# Altium schematic sheet BG95.SchDoc
size Tabloid; SheetNumber: 1; SheetTotal: 1
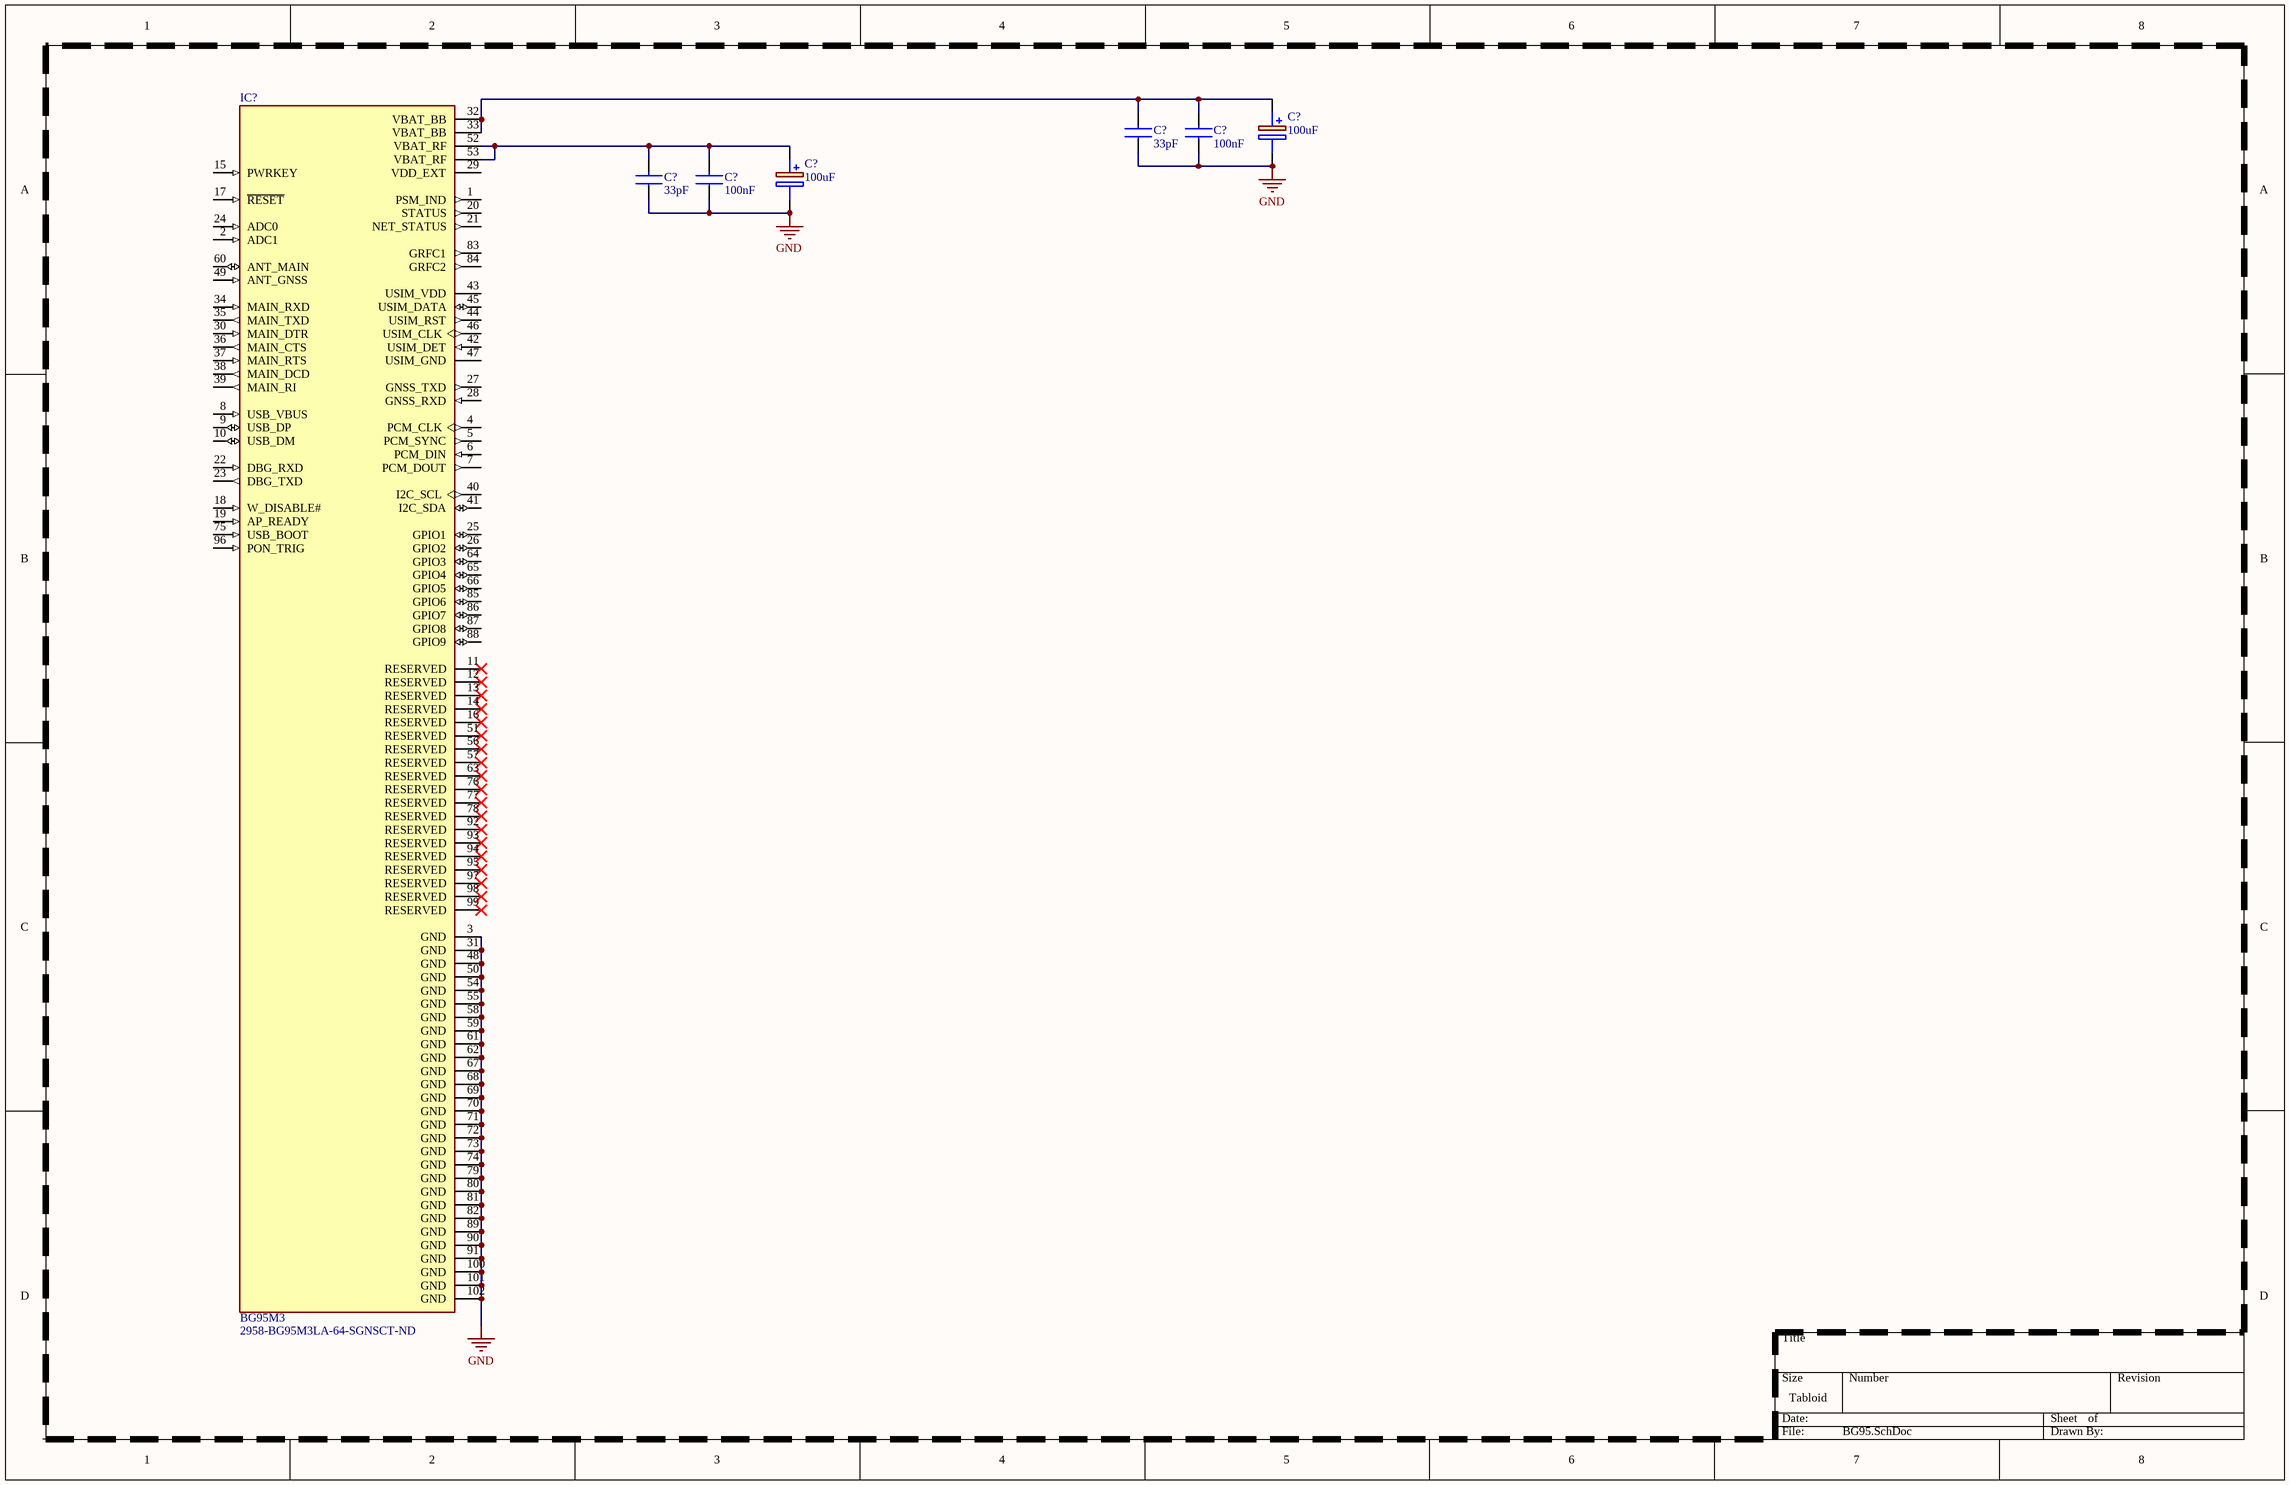
[diagram p0: BG95.SchDoc]

## Parts
(Parts that share a designator on the sheet are numbered #1, #2 ... from top to bottom, then left to right.)
C?#1  100uF  [865080343009]
C?#2  100uF  [865080343009]
C?#3  33pF  [CAPC1005X55N]
C?#4  100nF  [CAPC1005X55N]
C?#5  33pF  [CAPC1005X55N]
C?#6  100nF  [CAPC1005X55N]
IC?  BG95M3  Supplier Part Number 1: 2958-BG95M3LA-64-SGNSCT-ND  [XCVR_BG95M3LA-64-SGNS]

## Nets
GND: C?#1.2(-) C?#2.2(-) C?#3.1 C?#4.1 C?#5.1 C?#6.1 IC?.3(GND) IC?.31(GND) IC?.48(GND) IC?.50(GND) IC?.54(GND) IC?.55(GND) IC?.58(GND) IC?.59(GND) IC?.61(GND) IC?.62(GND) IC?.67(GND) IC?.68(GND) IC?.69(GND) IC?.70(GND) IC?.71(GND) IC?.72(GND) IC?.73(GND) IC?.74(GND) IC?.79(GND) IC?.80(GND) IC?.81(GND) IC?.82(GND) IC?.89(GND) IC?.90(GND) IC?.91(GND) IC?.100(GND) IC?.101(GND) IC?.102(GND)
NetC?#1_1: C?#1.1(+) C?#3.2 C?#4.2 IC?.32(VBAT_BB) IC?.33(VBAT_BB)
NetC?#2_1: C?#2.1(+) C?#5.2 C?#6.2 IC?.52(VBAT_RF) IC?.53(VBAT_RF)

Not connected (* = marked no-connect by the designer): IC? 1(PSM_IND) 2(ADC1) 4(PCM_CLK) 5(PCM_SYNC) 6(PCM_DIN) 7(PCM_DOUT) 8(USB_VBUS) 9(USB_DP) 10(USB_DM) 11(RESERVED)* 12(RESERVED)* 13(RESERVED)* 14(RESERVED)* 15(PWRKEY) 16(RESERVED)* 17(~{RESET}) 18(W_DISABLE#) 19(AP_READY) 20(STATUS) 21(NET_STATUS) 22(DBG_RXD) 23(DBG_TXD) 24(ADC0) 25(GPIO1) 26(GPIO2) 27(GNSS_TXD) 28(GNSS_RXD) 29(VDD_EXT) 30(MAIN_DTR) 34(MAIN_RXD) 35(MAIN_TXD) 36(MAIN_CTS) 37(MAIN_RTS) 38(MAIN_DCD) 39(MAIN_RI) 40(I2C_SCL) 41(I2C_SDA) 42(USIM_DET) 43(USIM_VDD) 44(USIM_RST) 45(USIM_DATA) 46(USIM_CLK) 47(USIM_GND) 49(ANT_GNSS) 51(RESERVED)* 56(RESERVED)* 57(RESERVED)* 60(ANT_MAIN) 63(RESERVED)* 64(GPIO3) 65(GPIO4) 66(GPIO5) 75(USB_BOOT) 76(RESERVED)* 77(RESERVED)* 78(RESERVED)* 83(GRFC1) 84(GRFC2) 85(GPIO6) 86(GPIO7) 87(GPIO8) 88(GPIO9) 92(RESERVED)* 93(RESERVED)* 94(RESERVED)* 95(RESERVED)* 96(PON_TRIG) 97(RESERVED)* 98(RESERVED)* 99(RESERVED)*

## Library data of the parts
C?#1 C?#2 = 865080343009: Alum. Electrolytic Cap 100uF 16V 6.3mmV-Chip WCAP-ASLI, Lifetime 2000h +105oC; Manufacturer: Wurth Elektronik; Value: 100µF; ESR (Equivalent Series Resistance): 399.422mΩ; Impedance: 520mΩ; Insulation Resistance: 1MΩ; Leakage Current: 16µA; Life (Hours): 2000hours; Polarity: Polar; Ripple Current: 255mA; Tolerance: 20%; Supplier: DigiKey; Supplier Part Number: 732-8419-1-ND; Manufacturer Part Number: 865080343009; RoHS: Compliant; Category: Aluminum Electrolytic Capacitors; Stock: 52412; Pricing: 1=0.28, 50=0.241, 100=0.21, 250=0.186, 500=0.163 (USD); Case/Package: Radial; Diameter: 6.3mm; Height: 5.5mm; Height - Seated (Max): 5.5118mm; Lead Free: Lead Free; Length: 5.5mm; Max Operating Temperature: 105°C; Min Operating Temperature: -55°C; Mounting Technology: Surface Mount; REACH SVHC: Unknown; Ripple Current (AC): 255mA; Voltage Rating: 16V; Voltage Rating (DC): 16V; Width: 6.6mm; ComponentLink1URL: https://datasheet.octopart.com:443/865080343009-Wurth-Elektronik-datasheet-168508400.pdf?src-supplier=Farnell; ComponentLink1Description: https://datasheet.octopart.com:443/865080343009-Wurth-Elektronik-datasheet-168508400.pdf?src-supplier=Farnell; ComponentLink2URL: https://datasheet.octopart.com:443/865080343009-W%C3%BCrth-Elektronik-datasheet-37144384.pdf?src-supplier=Future+Electronics; ComponentLink2Description: https://datasheet.octopart.com:443/865080343009-W%C3%BCrth-Elektronik-datasheet-37144384.pdf?src-supplier=Future+Electronics
C?#3 C?#5 = CL05C330JB5NNNC: 50V 33pF C0G ±5% 0402 Multilayer Ceramic Capacitors MLCC - SMD/SMT ROHS; Manufacturer: Samsung Electro-Mechanics; Temperature Coefficient: 30ppm/°C; Supplier: DigiKey; Supplier Part Number: 1276-1272-6-ND; Manufacturer Part Number: CL05C330JB5NNNC; RoHS: Compliant; Category: Ceramic Capacitors; Stock: 3336272; Pricing: 1=0.08, 10=0.005, 50=0.004, 100=0.0032 (USD); Value: 33pF; Case/Package: 0402; Case Code (Imperial): 0402; Case Code (Metric): 1005; China RoHS: Compliant; Contact Plating: Tin; Depth: 500µm; Dielectric: C0G; Dielectric Material: Ceramic; Height: 550µm; Lead Free: Lead Free; Length: 1mm; Lifecycle Status: Production; Material: Ceramic; Max Operating Temperature: 125°C; Min Operating Temperature: -55°C; Mounting Technology: Surface Mount; Number of Terminals: 2; Radiation Hardening: No; REACH SVHC: Yes; Schedule B: 8532240020, 8532240020|8532240020, 8532240020|8532240020|8532240020, 8532240020|8532240020|8532240020|8532240020; Thickness: 558.8µm; Tolerance: 5%; Voltage: 50V; Voltage Rating: 50V; Voltage Rating (DC): 50V; Width: 500µm; ComponentLink1URL: https://datasheet.octopart.com:443/CL05C330JB5NNNC-Samsung-Electro-Mechanics-datasheet-136482269.pdf?src-supplier=IHS; ComponentLink1Description: https://datasheet.octopart.com:443/CL05C330JB5NNNC-Samsung-Electro-Mechanics-datasheet-136482269.pdf?src-supplier=IHS; ComponentLink2URL: https://datasheet.octopart.com:443/CL05C330JB5NNNC-Samsung-Electro-Mechanics-datasheet-141347004.pdf?src-supplier=Samsung+SCT; ComponentLink2Description: https://datasheet.octopart.com:443/CL05C330JB5NNNC-Samsung-Electro-Mechanics-datasheet-141347004.pdf?src-supplier=Samsung+SCT; ComponentLink3URL: https://datasheet.octopart.com:443/CL05C330JB5NNNC-Samsung-Electro-Mechanics-datasheet-110326805.pdf?src-supplier=Future+Electronics; ComponentLink3Description: https://datasheet.octopart.com:443/CL05C330JB5NNNC-Samsung-Electro-Mechanics-datasheet-110326805.pdf?src-supplier=Future+Electronics; ComponentLink4URL: https://datasheet.octopart.com:443/CL05C330JB5NNNC-Samsung-Electro-Mechanics-datasheet-81461748.pdf?src-supplier=Future+Electronics; ComponentLink4Description: https://datasheet.octopart.com:443/CL05C330JB5NNNC-Samsung-Electro-Mechanics-datasheet-81461748.pdf?src-supplier=Future+Electronics; ComponentLink5URL: https://datasheet.octopart.com:443/CL05C330JB5NNNC-Samsung-datasheet-12522687.pdf?src-supplier=Future+Electronics; ComponentLink5Description: https://datasheet.octopart.com:443/CL05C330JB5NNNC-Samsung-datasheet-12522687.pdf?src-supplier=Future+Electronics; ComponentLink6URL: https://datasheet.octopart.com:443/CL05C330JB5NNNC-Samsung-datasheet-26589087.pdf?src-supplier=Future+Electronics; ComponentLink6Description: https://datasheet.octopart.com:443/CL05C330JB5NNNC-Samsung-datasheet-26589087.pdf?src-supplier=Future+Electronics; ComponentLink7URL: https://datasheet.octopart.com:443/CL05C330JB5NNNC-Samsung-Electro-Mechanics-datasheet-149156440.pdf?src-supplier=Future+Electronics; ComponentLink7Description: https://datasheet.octopart.com:443/CL05C330JB5NNNC-Samsung-Electro-Mechanics-datasheet-149156440.pdf?src-supplier=Future+Electronics; ComponentLink8URL: https://datasheet.octopart.com:443/CL05C330JB5NNNC-Samsung-datasheet-37081328.pdf?src-supplier=Future+Electronics; ComponentLink8Description: https://datasheet.octopart.com:443/CL05C330JB5NNNC-Samsung-datasheet-37081328.pdf?src-supplier=Future+Electronics; ComponentLink9URL: https://datasheet.octopart.com/CL05C330JB5NNNC-Samsung-Electro-Mechanics-datasheet-97040617.pdf; ComponentLink9Description: https://datasheet.octopart.com/CL05C330JB5NNNC-Samsung-Electro-Mechanics-datasheet-97040617.pdf; ComponentLink10URL: https://datasheet.octopart.com/CL05C330JB5NNNC-Samsung-Electro-Mechanics-datasheet-8324245.pdf; ComponentLink10Description: https://datasheet.octopart.com/CL05C330JB5NNNC-Samsung-Electro-Mechanics-datasheet-8324245.pdf; ComponentLink11URL: https://datasheet.octopart.com:443/CL05C330JB5NNNC-Samsung-datasheet-8326407.pdf?src-supplier=TME; ComponentLink11Description: https://datasheet.octopart.com:443/CL05C330JB5NNNC-Samsung-datasheet-8326407.pdf?src-supplier=TME
C?#4 C?#6 = CL05B104KP5NNNC: 10V 100nF X7R ±10% 0402 Multilayer Ceramic Capacitors MLCC - SMD/SMT ROHS; Manufacturer: Samsung Electro-Mechanics; Supplier: DigiKey; Supplier Part Number: 1276-1002-1-ND; Manufacturer Part Number: CL05B104KP5NNNC; RoHS: Compliant; Category: Ceramic Capacitors; Stock: 29106597; Pricing: 1=0.08, 10=0.004 (USD); Value: 100nF; Case/Package: 0402; Case Code (Imperial): 0402; Case Code (Metric): 1005; China RoHS: Compliant; Contact Plating: Tin; Depth: 500µm; Dielectric: X7R; Dielectric Material: Ceramic; Height: 500µm; Length: 1mm; Lifecycle Status: Production; Material: Ceramic; Max Operating Temperature: 125°C; Min Operating Temperature: -55°C; Mounting Technology: Surface Mount; Number of Terminals: 2; Radiation Hardening: No; REACH SVHC: Yes; Schedule B: 8532240020, 8532240020|8532240020, 8532240020|8532240020|8532240020, 8532240020|8532240020|8532240020|8532240020; Thickness: 558.8µm; Tolerance: 10%; Voltage Rating: 10V; Voltage Rating (DC): 10V; Width: 500µm; ComponentLink1URL: https://datasheet.octopart.com:443/CL05B104KP5NNNC-Samsung-Electro-Mechanics-datasheet-182018737.pdf?src-supplier=IHS; ComponentLink1Description: https://datasheet.octopart.com:443/CL05B104KP5NNNC-Samsung-Electro-Mechanics-datasheet-182018737.pdf?src-supplier=IHS; ComponentLink2URL: https://datasheet.octopart.com/CL05B104KP5NNNC-Samsung-Electro-Mechanics-datasheet-8324245.pdf; ComponentLink2Description: https://datasheet.octopart.com/CL05B104KP5NNNC-Samsung-Electro-Mechanics-datasheet-8324245.pdf; ComponentLink3URL: https://datasheet.octopart.com/CL05B104KP5NNNC-Samsung-Electro-Mechanics-datasheet-97040617.pdf; ComponentLink3Description: https://datasheet.octopart.com/CL05B104KP5NNNC-Samsung-Electro-Mechanics-datasheet-97040617.pdf; ComponentLink4URL: https://datasheet.octopart.com/General-Multilayer-Ceramic-Capacitors-Samsung-datasheet-family-111.pdf; ComponentLink4Description: https://datasheet.octopart.com/General-Multilayer-Ceramic-Capacitors-Samsung-datasheet-family-111.pdf; ComponentLink5URL: https://datasheet.octopart.com:443/CL05B104KP5NNNC-Samsung-Electro-Mechanics-datasheet-141346865.pdf?src-supplier=Samsung+SCT; ComponentLink5Description: https://datasheet.octopart.com:443/CL05B104KP5NNNC-Samsung-Electro-Mechanics-datasheet-141346865.pdf?src-supplier=Samsung+SCT; ComponentLink6URL: https://datasheet.octopart.com:443/CL05B104KP5NNNC-Samsung-Electro-Mechanics-datasheet-116890912.pdf?src-supplier=Future+Electronics; ComponentLink6Description: https://datasheet.octopart.com:443/CL05B104KP5NNNC-Samsung-Electro-Mechanics-datasheet-116890912.pdf?src-supplier=Future+Electronics; ComponentLink7URL: https://datasheet.octopart.com:443/CL05B104KP5NNNC-Samsung-Electro-Mechanics-datasheet-81461625.pdf?src-supplier=Future+Electronics; ComponentLink7Description: https://datasheet.octopart.com:443/CL05B104KP5NNNC-Samsung-Electro-Mechanics-datasheet-81461625.pdf?src-supplier=Future+Electronics; ComponentLink8URL: https://datasheet.octopart.com:443/CL05B104KP5NNNC-Samsung-datasheet-42485124.pdf?src-supplier=Future+Electronics; ComponentLink8Description: https://datasheet.octopart.com:443/CL05B104KP5NNNC-Samsung-datasheet-42485124.pdf?src-supplier=Future+Electronics; ComponentLink9URL: https://datasheet.octopart.com:443/CL05B104KP5NNNC-Samsung-datasheet-26589026.pdf?src-supplier=Future+Electronics; ComponentLink9Description: https://datasheet.octopart.com:443/CL05B104KP5NNNC-Samsung-datasheet-26589026.pdf?src-supplier=Future+Electronics; ComponentLink10URL: https://datasheet.octopart.com:443/CL05B104KP5NNNC-Samsung-Electro-Mechanics-datasheet-149136717.pdf?src-supplier=Future+Electronics; ComponentLink10Description: https://datasheet.octopart.com:443/CL05B104KP5NNNC-Samsung-Electro-Mechanics-datasheet-149136717.pdf?src-supplier=Future+Electronics; ComponentLink11URL: https://datasheet.octopart.com:443/CL05B104KP5NNNC-Samsung-Electro-Mechanics-datasheet-17925223.pdf?src-supplier=iiiC; ComponentLink11Description: https://datasheet.octopart.com:443/CL05B104KP5NNNC-Samsung-Electro-Mechanics-datasheet-17925223.pdf?src-supplier=iiiC; ComponentLink12URL: https://datasheet.octopart.com:443/CL05B104KP5NNNC-Samsung-datasheet-8326407.pdf?src-supplier=TME; ComponentLink12Description: https://datasheet.octopart.com:443/CL05B104KP5NNNC-Samsung-datasheet-8326407.pdf?src-supplier=TME; ComponentLink13URL: http://sigma.octopart.com:80/rohs_certificate/General-Multilayer-Ceramic-Capacitors-Samsung-family-110.pdf?src-supplier=Compliance+Statements; ComponentLink13Description: http://sigma.octopart.com:80/rohs_certificate/General-Multilayer-Ceramic-Capacitors-Samsung-family-110.pdf?src-supplier=Compliance+Statements; ComponentLink14URL: http://sigma.octopart.com:80/rohs_statement/General-Multilayer-Ceramic-Capacitors-Samsung-family-132.pdf?src-supplier=Compliance+Statements; ComponentLink14Description: http://sigma.octopart.com:80/rohs_statement/General-Multilayer-Ceramic-Capacitors-Samsung-family-132.pdf?src-supplier=Compliance+Statements; ComponentLink15URL: http://sigma.octopart.com:80/reach_statement/General-Multilayer-Ceramic-Capacitors-Samsung-family-133.pdf?src-supplier=Compliance+Statements; ComponentLink15Description: http://sigma.octopart.com:80/reach_statement/General-Multilayer-Ceramic-Capacitors-Samsung-family-133.pdf?src-supplier=Compliance+Statements
IC? = BG95M3LA-64-SGNS: CAT M1/CAT NB2Cellular Module 850MHz/900MHz/1800MHz/1900MHz M2M 102-Pin LGA Module; Manufacturer: Quectel Wireless Solutions; Supplier 1: Digikey; Manufacturer Part Number: BG95M3LA-64-SGNS; RoHS: No; Category: LDO; Stock 1: 1568; Pricing 1: 1=27.46, 10=23.977, 25=22.768, 100=21.1108 (USD); ComponentLink1URL: https://datasheet.octopart.com/BG95M3LA-64-SGNS-Quectel-datasheet-163886451.pdf?src-supplier=SOS+electronic; ComponentLink1Description: https://datasheet.octopart.com/BG95M3LA-64-SGNS-Quectel-datasheet-163886451.pdf?src-supplier=SOS+electronic